# EAGLE schematic LH_009 (EAGLE 7.3.0)
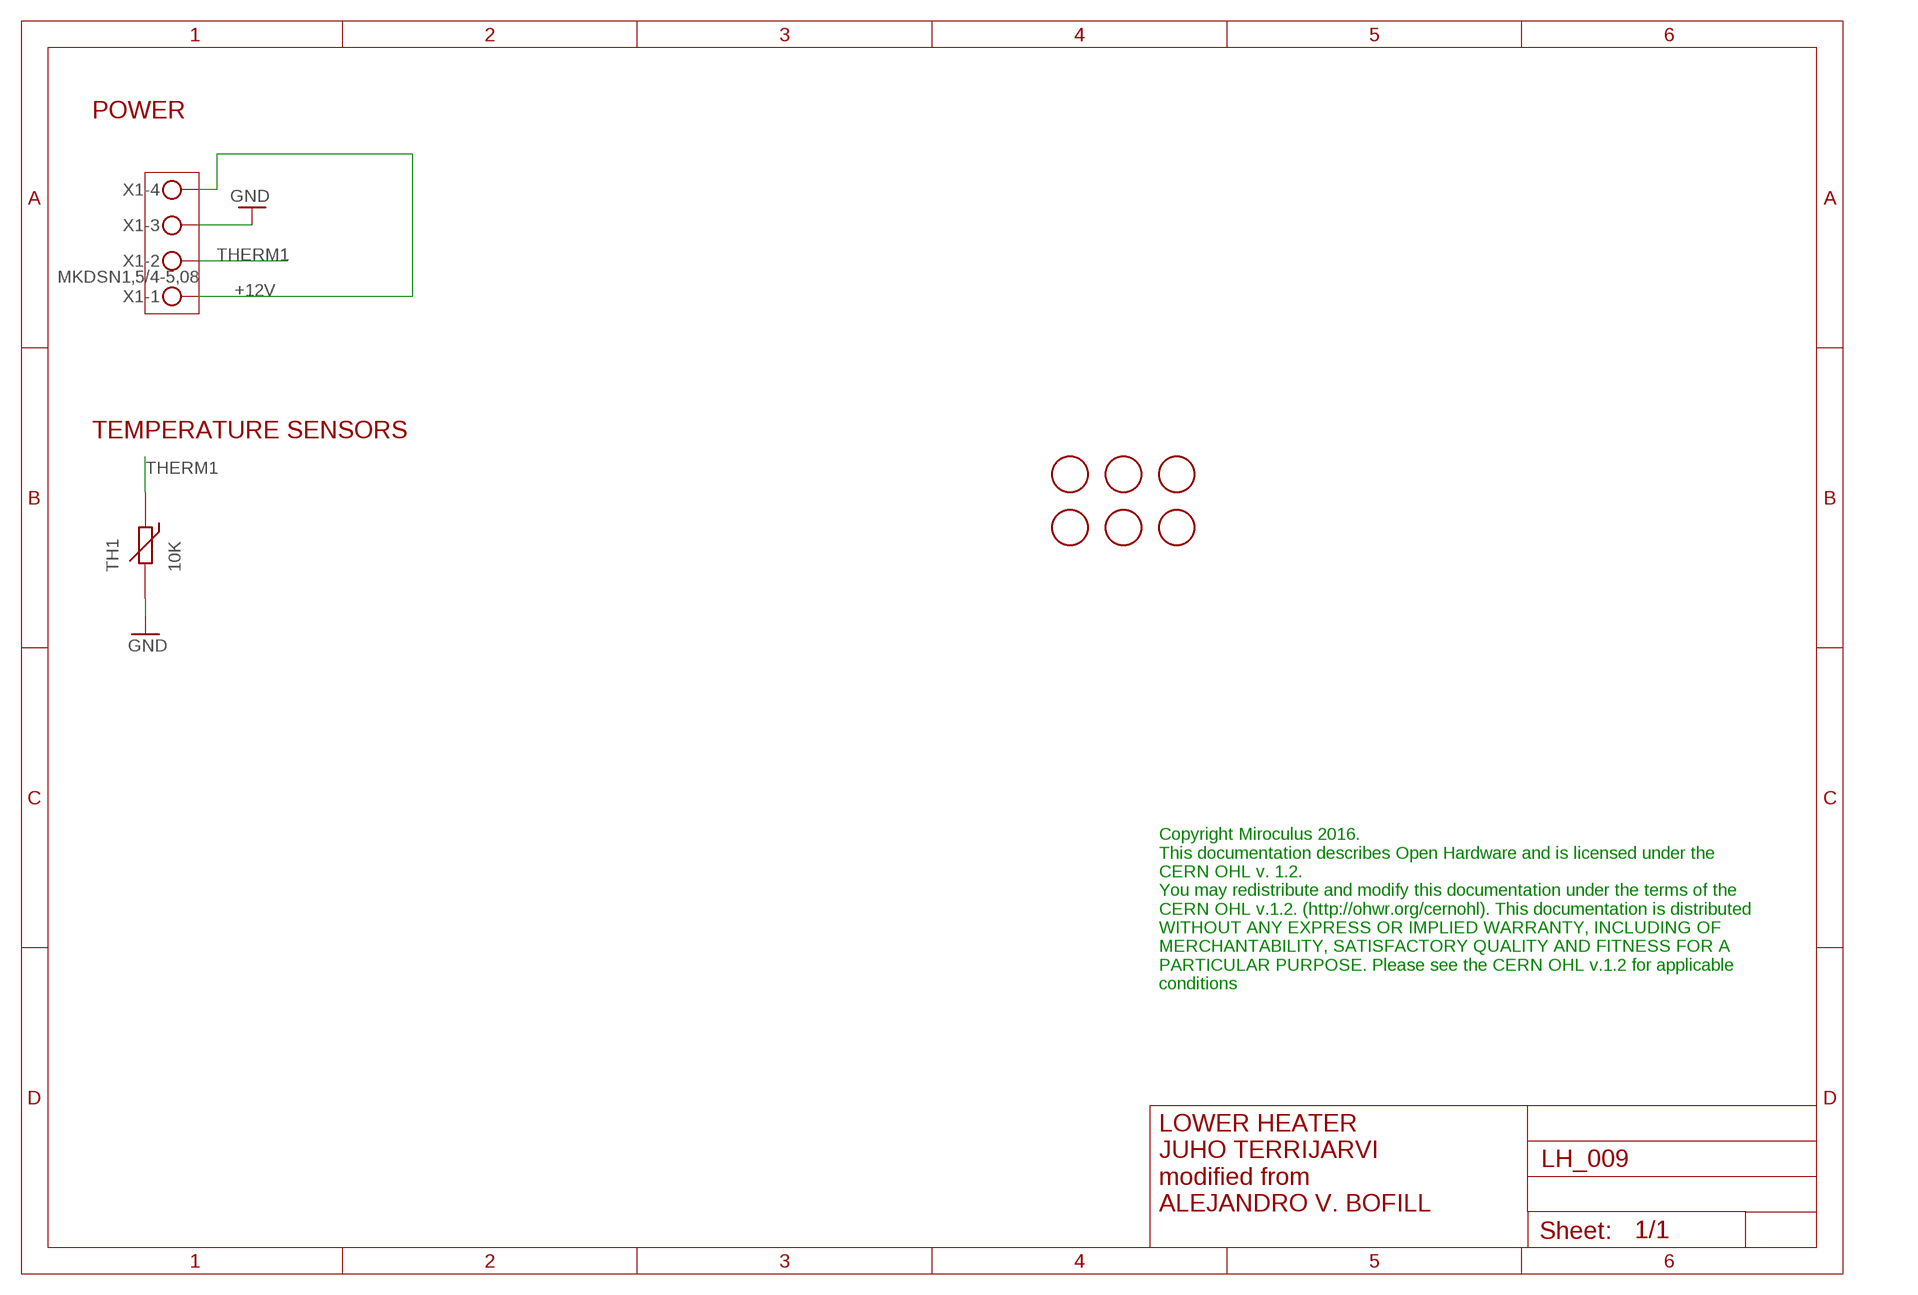
[diagram p0: schematic, sheet 1]

## Parts
FD1  FIDUCIALMOUNT  [FIDUCIA-MOUNT]
FD2  FIDUCIALMOUNT  [FIDUCIA-MOUNT]
FD3  FIDUCIALMOUNT  [FIDUCIA-MOUNT]
FD4  FIDUCIALMOUNT  [FIDUCIA-MOUNT]
FD5  FIDUCIALMOUNT  [FIDUCIA-MOUNT]
FD6  FIDUCIALMOUNT  [FIDUCIA-MOUNT]
TH1  10K  THERMISTOR_SMD_0603  [THERMISTOR_SMD_0603]
X1  MKDSN1,5/4-5,08  [MKDSN1,5/4-5,08]

## Nets
+12V: X1.1 X1.4
GND [gnd]: TH1.2 X1.3
THERM1: TH1.1 X1.2

## Notes on the sheet
- POWER
- TEMPERATURE SENSORS
- Copyright Miroculus 2016.
  This documentation describes Open Hardware and is licensed under the
  CERN OHL v. 1.2.
  You may redistribute and modify this documentation under the terms of the
  CERN OHL v.1.2. (http://ohwr.org/cernohl). This documentation is distributed
  WITHOUT ANY EXPRESS OR IMPLIED WARRANTY, INCLUDING OF
  MERCHANTABILITY, SATISFACTORY QUALITY AND FITNESS FOR A
  PARTICULAR PURPOSE. Please see the CERN OHL v.1.2 for applicable
  conditions
- LOWER HEATER
  JUHO TERRIJARVI
  modified from
  ALEJANDRO V. BOFILL

## Library data of the parts
FD1-FD6 = SmartPrj:FIDUCIALMOUNT
TH1 = Miroculus:THERMISTOR_SMD_0603
X1 = con-phoenix-508:MKDSN1,5/4-5,08: MKDSN 1,5/ 4-5,08 Printklemme Nennstrom: 13,5 A Nennspannung: 250 V Rastermaß: 5,08 mm Polzahl: 4 Anschlussart: Schraubanschluss Montage: Löten Anschlussrichtung Leiter/Platine: 0 ° Artikelnummer: 1729144 Source: http://eshop.phoenixcontact.com .. 1729144.pdf

## Net classes
0 default: width 0.254 mm, drill 0.406 mm, clearance 0.178 mm
1 power: width 0.254 mm, drill 0.406 mm, clearance 0.178 mm
2 gnd: width 0.254 mm, drill 0.406 mm, clearance 0.178 mm
3 power usb: width 0.254 mm, drill 0.406 mm, clearance 0.178 mm